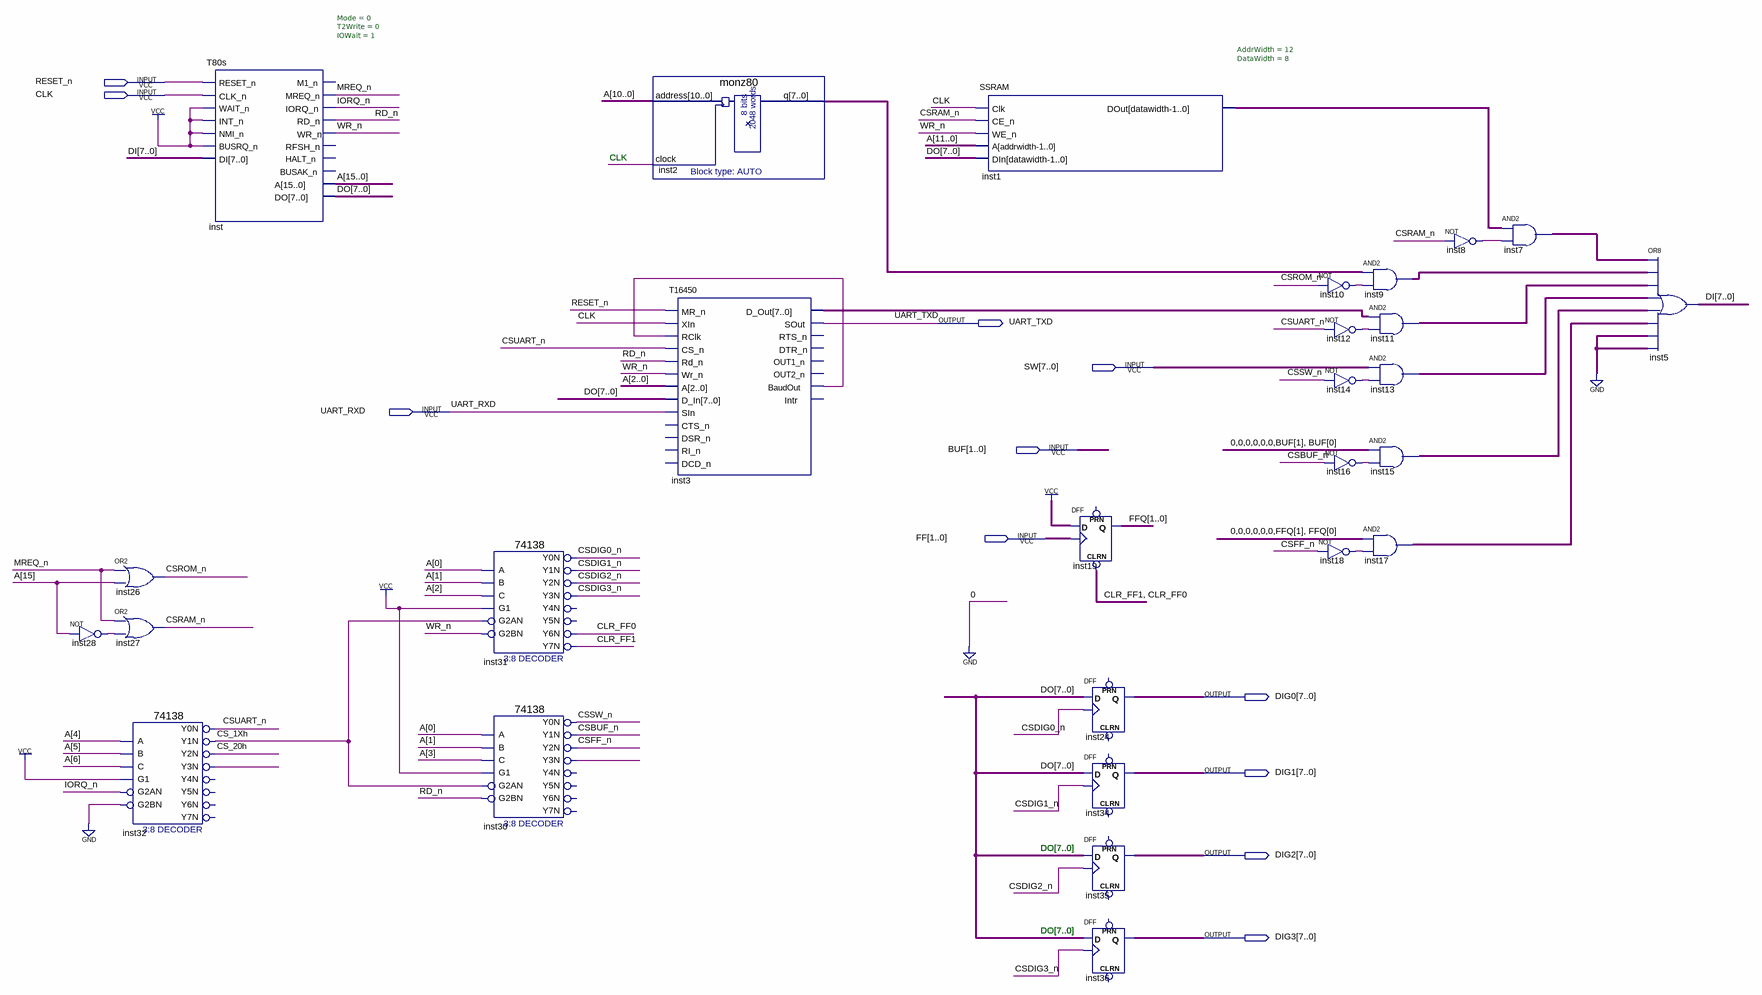
[diagram p0: schematic sheet]
// Quartus schematic t80_top_sch.bdf as structural Verilog: 28 symbols, 11 pins
module t80_top_sch (
  input  RESET_n,
  input  CLK,
  input  [7:0] SW,
  input  UART_RXD,
  input  [1:0] BUF,
  input  [1:0] FF,
  output UART_TXD,
  output [7:0] DIG0,
  output [7:0] DIG1,
  output [7:0] DIG2,
  output [7:0] DIG3
);

  wire CLR_FF0, CLR_FF1, CS_1Xh, CS_20h, CSBUF_n, CSDIG0_n, CSDIG1_n, CSDIG2_n, CSDIG3_n, CSFF_n, CSRAM_n,
       CSROM_n, CSSW_n, CSUART_n, inst3_baudout, inst8_out, inst10_out, inst12_out, inst14_out, inst16_out,
       inst18_out, inst28_out, inst30_y3n, inst32_y3n, IORQ_n, MREQ_n, RD_n, WR_n;
  wire [1:0] FFQ;
  wire [7:0] DI, DO, inst1_dout, inst2_q, inst3_d_out, inst7_out, inst9_out, inst11_out, inst13_out,
       inst15_out, inst17_out;
  wire [15:0] A;

  not inst28 (inst28_out, A[15]);
  or inst26 (CSROM_n, MREQ_n, A[15]);
  or inst27 (CSRAM_n, MREQ_n, inst28_out);
  \74138  inst32 (
    .A(A[4]), .B(A[5]), .G1(1'b1), .C(A[6]), .G2AN(IORQ_n), .G2BN(1'b0), .Y0N(CSUART_n), .Y1N(CS_1Xh),
    .Y2N(CS_20h), .Y3N(inst32_y3n));  // open: Y4N, Y5N, Y6N, Y7N
  T80s #(.Mode(0), .T2Write(0), .IOWait(1)) inst (
    .RESET_n(RESET_n), .CLK_n(CLK), .WAIT_n(1'b1), .INT_n(1'b1), .NMI_n(1'b1), .BUSRQ_n(1'b1), .DI(DI),
    .MREQ_n(MREQ_n), .IORQ_n(IORQ_n), .RD_n(RD_n), .WR_n(WR_n), .A(A), .DO(DO));  // open: M1_n, RFSH_n, HALT_n, BUSAK_n
  \74138  inst31 (
    .A(A[0]), .B(A[1]), .G1(1'b1), .C(A[2]), .G2AN(CS_1Xh), .G2BN(WR_n), .Y0N(CSDIG0_n), .Y1N(CSDIG1_n),
    .Y2N(CSDIG2_n), .Y3N(CSDIG3_n), .Y6N(CLR_FF0), .Y7N(CLR_FF1));  // open: Y4N, Y5N
  \74138  inst30 (
    .A(A[0]), .B(A[1]), .G1(1'b1), .C(A[3]), .G2AN(CS_1Xh), .G2BN(RD_n), .Y0N(CSSW_n), .Y1N(CSBUF_n),
    .Y2N(CSFF_n), .Y3N(inst30_y3n));  // open: Y4N, Y5N, Y6N, Y7N
  monz80 inst2 (.address(A[10:0]), .clock(CLK), .q(inst2_q));
  T16450 inst3 (
    .MR_n(RESET_n), .XIn(CLK), .RClk(inst3_baudout), .CS_n(CSUART_n), .Rd_n(RD_n), .Wr_n(WR_n), .A(A[2:0]),
    .D_In(DO), .SIn(UART_RXD), .D_Out(inst3_d_out), .SOut(UART_TXD), .BaudOut(inst3_baudout));  // open: CTS_n, DSR_n, RI_n, DCD_n, RTS_n, DTR_n, OUT1_n, OUT2_n, Intr
  SSRAM #(.AddrWidth(12), .DataWidth(8)) inst1 (
    .Clk(CLK), .CE_n(CSRAM_n), .WE_n(WR_n), .A(A[11:0]), .DIn(DO), .DOut(inst1_dout));
  DFF inst19[1:0] (.CLRN({CLR_FF1, CLR_FF0}), .CLK(FF), .D(2'b11), .Q(FFQ));  // open: PRN
  DFF inst24[7:0] (.CLK(CSDIG0_n), .D(DO), .Q(DIG0));  // open: CLRN, PRN
  DFF inst34[7:0] (.CLK(CSDIG1_n), .D(DO), .Q(DIG1));  // open: CLRN, PRN
  DFF inst35[7:0] (.CLK(CSDIG2_n), .D(DO), .Q(DIG2));  // open: CLRN, PRN
  DFF inst36[7:0] (.CLK(CSDIG3_n), .D(DO), .Q(DIG3));  // open: CLRN, PRN
  not inst10 (inst10_out, CSROM_n);
  not inst12 (inst12_out, CSUART_n);
  not inst14 (inst14_out, CSSW_n);
  not inst16 (inst16_out, CSBUF_n);
  not inst18 (inst18_out, CSFF_n);
  assign inst9_out = inst2_q & {8{inst10_out}};  // AND2 inst9, 8 bits wide
  assign inst11_out = inst3_d_out & {8{inst12_out}};  // AND2 inst11, 8 bits wide
  assign inst13_out = SW & {8{inst14_out}};  // AND2 inst13, 8 bits wide
  assign inst15_out = {{6{1'b0}}, BUF} & {8{inst16_out}};  // AND2 inst15, 8 bits wide
  assign inst17_out = {{6{1'b0}}, FFQ} & {8{inst18_out}};  // AND2 inst17, 8 bits wide
  not inst8 (inst8_out, CSRAM_n);
  assign inst7_out = inst1_dout & {8{inst8_out}};  // AND2 inst7, 8 bits wide
  assign DI = inst7_out | inst9_out | inst11_out | inst13_out | inst15_out | inst17_out | {8{1'b0}} | {8{1'b0}};  // OR8 inst5, 8 bits wide

  // Notes on the sheet:
  //   CLK
  //   DO[7..0]
  //   DO[7..0]
  //   DO[7..0]
  //   DO[7..0]
  //   DO[7..0]
endmodule
